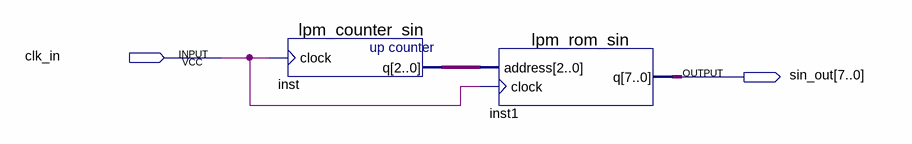
[diagram p0: schematic sheet]
// Quartus schematic Sin.bdf as structural Verilog: 2 symbols, 2 pins
module Sin (
  input  clk_in,
  output [7:0] sin_out
);

  wire [2:0] inst_q;

  lpm_counter_sin inst (.clock(clk_in), .q(inst_q));
  lpm_rom_sin inst1 (.address(inst_q), .clock(clk_in), .q(sin_out));
endmodule
